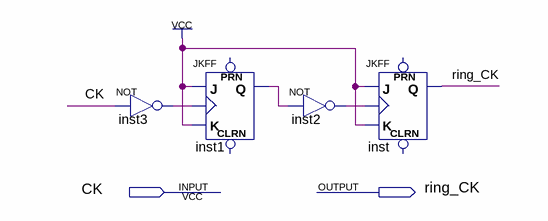
[diagram p0: schematic sheet]
// Quartus schematic 4_MOD_A_U.bdf as structural Verilog: 4 symbols, 2 pins
module \4_MOD_A_U  (
  input  CK,
  output ring_CK
);

  wire inst1_q, inst2_out, inst3_out;

  not inst3 (inst3_out, CK);
  JKFF inst1 (.K(1'b1), .J(1'b1), .CLK(inst3_out), .Q(inst1_q));  // open: PRN, CLRN
  not inst2 (inst2_out, inst1_q);
  JKFF inst (.K(1'b1), .J(1'b1), .CLK(inst2_out), .Q(ring_CK));  // open: PRN, CLRN
endmodule
